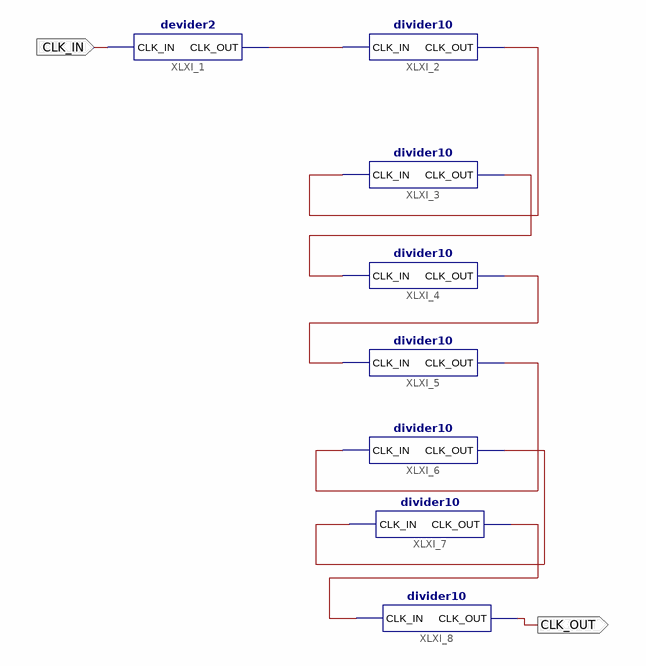
[diagram p0: schematic sheet 1]
// Xilinx ISE schematic divider.sch (spartan6) as structural Verilog: 8 symbols, 2 ports
module divider (
  input  CLK_IN,
  output CLK_OUT
);

  wire XLXN_1, XLXN_3, XLXN_4, XLXN_5, XLXN_6, XLXN_7, XLXN_8;

  devider2 XLXI_1 (.CLK_IN(CLK_IN), .CLK_OUT(XLXN_1));
  divider10 XLXI_2 (.CLK_IN(XLXN_1), .CLK_OUT(XLXN_3));
  divider10 XLXI_3 (.CLK_IN(XLXN_3), .CLK_OUT(XLXN_4));
  divider10 XLXI_4 (.CLK_IN(XLXN_4), .CLK_OUT(XLXN_5));
  divider10 XLXI_5 (.CLK_IN(XLXN_5), .CLK_OUT(XLXN_6));
  divider10 XLXI_6 (.CLK_IN(XLXN_6), .CLK_OUT(XLXN_7));
  divider10 XLXI_7 (.CLK_IN(XLXN_7), .CLK_OUT(XLXN_8));
  divider10 XLXI_8 (.CLK_IN(XLXN_8), .CLK_OUT(CLK_OUT));
endmodule
